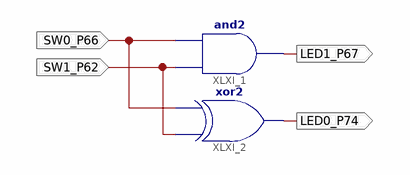
[diagram p0: schematic sheet 1]
// Xilinx ISE schematic Lab_00.sch (spartan6) as structural Verilog: 2 symbols, 4 ports
module Lab_00 (
  input  SW1_P62,
  input  SW0_P66,
  output LED1_P67,
  output LED0_P74
);

  and XLXI_1 (LED1_P67, SW1_P62, SW0_P66);
  xor XLXI_2 (LED0_P74, SW1_P62, SW0_P66);
endmodule
